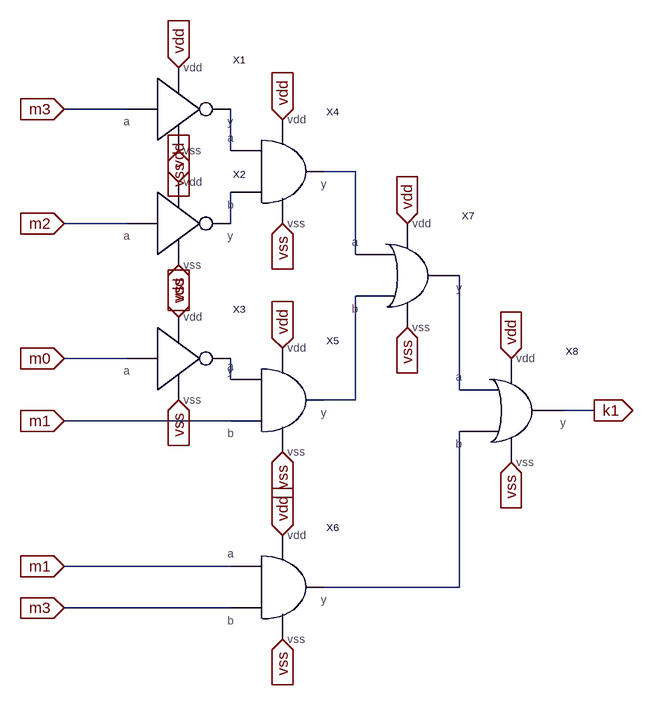
[diagram p0: schematic m_key.asc]
m_key.asc, the LTspice schematic file:
Version 4
SHEET 1 904 824
WIRE 96 -64 0 -64
WIRE 256 0 256 -64
WIRE 448 32 400 32
WIRE 96 112 0 112
WIRE 256 112 256 64
WIRE 448 160 448 32
WIRE 96 320 0 320
WIRE 256 352 256 320
WIRE 608 368 608 192
WIRE 448 384 448 224
WIRE 448 384 400 384
WIRE 816 400 768 400
WIRE 256 416 0 416
WIRE 256 640 0 640
WIRE 608 672 608 432
WIRE 608 672 400 672
WIRE 256 704 0 704
FLAG 176 -128 vdd
IOPIN 176 -128 In
FLAG 336 -48 vdd
IOPIN 336 -48 In
FLAG 176 256 vdd
IOPIN 176 256 In
FLAG 336 304 vdd
IOPIN 336 304 In
FLAG 336 592 vdd
IOPIN 336 592 In
FLAG 688 320 vdd
IOPIN 688 320 In
FLAG 176 0 vss
IOPIN 176 0 In
FLAG 176 176 vss
IOPIN 176 176 In
FLAG 336 112 vss
IOPIN 336 112 In
FLAG 336 464 vss
IOPIN 336 464 In
FLAG 336 752 vss
IOPIN 336 752 In
FLAG 688 480 vss
IOPIN 688 480 In
FLAG 0 -64 m3
IOPIN 0 -64 In
FLAG 0 112 m2
IOPIN 0 112 In
FLAG 0 320 m0
IOPIN 0 320 In
FLAG 0 416 m1
IOPIN 0 416 In
FLAG 0 640 m1
IOPIN 0 640 In
FLAG 0 704 m3
IOPIN 0 704 In
FLAG 816 400 k1
IOPIN 816 400 Out
FLAG 176 48 vdd
IOPIN 176 48 In
FLAG 528 272 vss
IOPIN 528 272 In
FLAG 528 112 vdd
IOPIN 528 112 In
FLAG 176 384 vss
IOPIN 176 384 In
SYMBOL not 176 -64 R0
SYMATTR InstName X1
SYMBOL not 176 112 R0
SYMATTR InstName X2
SYMBOL not 176 320 R0
SYMATTR InstName X3
SYMBOL and 336 32 R0
SYMATTR InstName X4
SYMBOL and 336 384 R0
SYMATTR InstName X5
SYMBOL and 336 672 R0
SYMATTR InstName X6
SYMBOL or 528 192 R0
SYMATTR InstName X7
SYMBOL or 688 400 R0
SYMATTR InstName X8

The netlist it stands for:
* m_key.asc
XX1 m3 N001 vdd vss not  ; pins a y vdd vss
XX2 m2 N003 vdd vss not  ; pins a y vdd vss
XX3 m0 N004 vdd vss not  ; pins a y vdd vss
XX4 N001 N003 N002 vdd vss and  ; pins a b y vdd vss
XX5 N004 m1 N006 vdd vss and  ; pins a b y vdd vss
XX6 m1 m3 N007 vdd vss and  ; pins a b y vdd vss
XX7 N002 N006 N005 vdd vss or  ; pins a b y vdd vss
XX8 N005 N007 k1 vdd vss or  ; pins a b y vdd vss
.backanno
.end